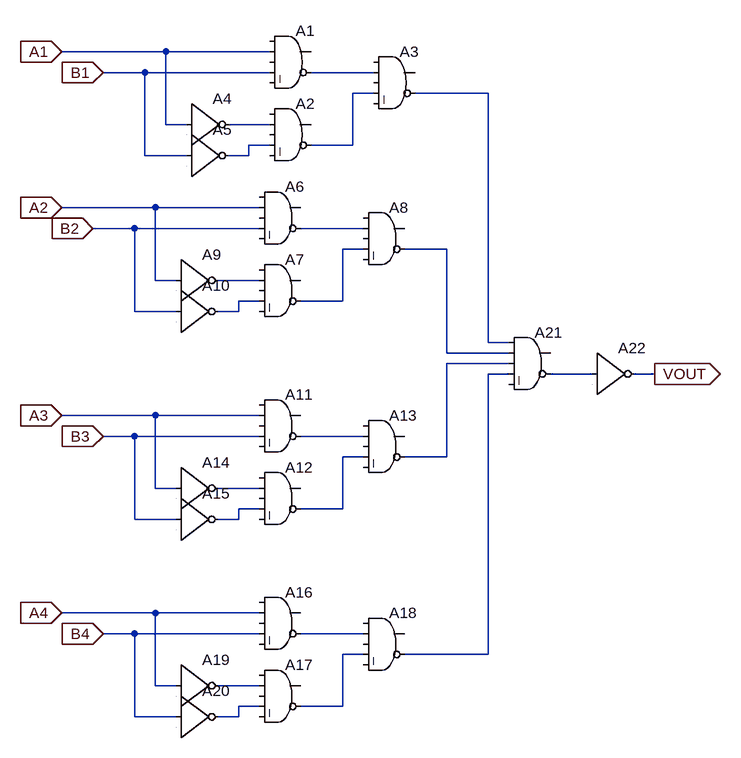
[diagram p0: schematic comp.asc]
comp.asc, the LTspice schematic file:
Version 4
SHEET 1 2100 968
WIRE 592 -176 432 -176
WIRE 752 -176 592 -176
WIRE 560 -144 496 -144
WIRE 752 -144 560 -144
WIRE 912 -144 816 -144
WIRE 912 -112 880 -112
WIRE 1088 -112 976 -112
WIRE 592 -64 592 -176
WIRE 624 -64 592 -64
WIRE 752 -64 688 -64
WIRE 752 -32 720 -32
WIRE 880 -32 880 -112
WIRE 880 -32 816 -32
WIRE 560 -16 560 -144
WIRE 624 -16 560 -16
WIRE 720 -16 720 -32
WIRE 720 -16 688 -16
WIRE 576 64 432 64
WIRE 736 64 576 64
WIRE 544 96 480 96
WIRE 736 96 544 96
WIRE 896 96 800 96
WIRE 896 128 864 128
WIRE 1024 128 960 128
WIRE 576 176 576 64
WIRE 608 176 576 176
WIRE 736 176 672 176
WIRE 736 208 704 208
WIRE 864 208 864 128
WIRE 864 208 800 208
WIRE 544 224 544 96
WIRE 608 224 544 224
WIRE 704 224 704 208
WIRE 704 224 672 224
WIRE 1088 272 1088 -112
WIRE 1120 272 1088 272
WIRE 1024 288 1024 128
WIRE 1120 288 1024 288
WIRE 1120 304 1024 304
WIRE 1120 320 1088 320
WIRE 1248 320 1184 320
WIRE 1344 320 1312 320
WIRE 576 384 432 384
WIRE 736 384 576 384
WIRE 544 416 496 416
WIRE 736 416 544 416
WIRE 896 416 800 416
WIRE 896 448 864 448
WIRE 1024 448 1024 304
WIRE 1024 448 960 448
WIRE 576 496 576 384
WIRE 608 496 576 496
WIRE 736 496 672 496
WIRE 736 528 704 528
WIRE 864 528 864 448
WIRE 864 528 800 528
WIRE 544 544 544 416
WIRE 608 544 544 544
WIRE 704 544 704 528
WIRE 704 544 672 544
WIRE 576 688 432 688
WIRE 736 688 576 688
WIRE 544 720 496 720
WIRE 736 720 544 720
WIRE 896 720 800 720
WIRE 896 752 864 752
WIRE 1088 752 1088 320
WIRE 1088 752 960 752
WIRE 576 800 576 688
WIRE 608 800 576 800
WIRE 736 800 672 800
WIRE 736 832 704 832
WIRE 864 832 864 752
WIRE 864 832 800 832
WIRE 544 848 544 720
WIRE 608 848 544 848
WIRE 704 848 704 832
WIRE 704 848 672 848
FLAG 432 64 A2
IOPIN 432 64 In
FLAG 432 384 A3
IOPIN 432 384 In
FLAG 432 688 A4
IOPIN 432 688 In
FLAG 432 -176 A1
IOPIN 432 -176 In
FLAG 496 -144 B1
IOPIN 496 -144 In
FLAG 480 96 B2
IOPIN 480 96 In
FLAG 496 416 B3
IOPIN 496 416 In
FLAG 496 720 B4
IOPIN 496 720 In
FLAG 1344 320 VOUT
IOPIN 1344 320 Out
SYMBOL Digital\\and 784 -224 R0
SYMATTR InstName A1
SYMBOL Digital\\and 784 -112 R0
SYMATTR InstName A2
SYMBOL Digital\\and 944 -192 R0
SYMATTR InstName A3
SYMBOL Digital\\inv 624 -128 R0
SYMATTR InstName A4
SYMBOL Digital\\inv 624 -80 R0
SYMATTR InstName A5
SYMBOL Digital\\and 768 16 R0
SYMATTR InstName A6
SYMBOL Digital\\and 768 128 R0
SYMATTR InstName A7
SYMBOL Digital\\and 928 48 R0
SYMATTR InstName A8
SYMBOL Digital\\inv 608 112 R0
SYMATTR InstName A9
SYMBOL Digital\\inv 608 160 R0
SYMATTR InstName A10
SYMBOL Digital\\and 768 336 R0
SYMATTR InstName A11
SYMBOL Digital\\and 768 448 R0
SYMATTR InstName A12
SYMBOL Digital\\and 928 368 R0
SYMATTR InstName A13
SYMBOL Digital\\inv 608 432 R0
SYMATTR InstName A14
SYMBOL Digital\\inv 608 480 R0
SYMATTR InstName A15
SYMBOL Digital\\and 768 640 R0
SYMATTR InstName A16
SYMBOL Digital\\and 768 752 R0
SYMATTR InstName A17
SYMBOL Digital\\and 928 672 R0
SYMATTR InstName A18
SYMBOL Digital\\inv 608 736 R0
SYMATTR InstName A19
SYMBOL Digital\\inv 608 784 R0
SYMATTR InstName A20
SYMBOL Digital\\and 1152 240 R0
SYMATTR InstName A21
SYMBOL Digital\\inv 1248 256 R0
SYMATTR InstName A22

The netlist it stands for:
* comp.asc
A1 0 A1 0 B1 0 N001 0 0 AND
A2 0 N004 0 N005 0 N002 0 0 AND
A3 0 N001 0 N002 0 N003 0 0 AND
A4 A1 0 0 0 0 N004 0 0 BUF
A5 B1 0 0 0 0 N005 0 0 BUF
A6 0 A2 0 B2 0 N006 0 0 AND
A7 0 N009 0 N010 0 N007 0 0 AND
A8 0 N006 0 N007 0 N008 0 0 AND
A9 A2 0 0 0 0 N009 0 0 BUF
A10 B2 0 0 0 0 N010 0 0 BUF
A11 0 A3 0 B3 0 N014 0 0 AND
A12 0 N016 0 N017 0 N015 0 0 AND
A13 0 N014 0 N015 0 N011 0 0 AND
A14 A3 0 0 0 0 N016 0 0 BUF
A15 B3 0 0 0 0 N017 0 0 BUF
A16 0 A4 0 B4 0 N018 0 0 AND
A17 0 N020 0 N021 0 N019 0 0 AND
A18 0 N018 0 N019 0 N012 0 0 AND
A19 A4 0 0 0 0 N020 0 0 BUF
A20 B4 0 0 0 0 N021 0 0 BUF
A21 N003 N008 N011 N012 0 N013 0 0 AND
A22 N013 0 0 0 0 VOUT 0 0 BUF
.backanno
.end